# Altium schematic sheet MPU9150.SchDoc
size A
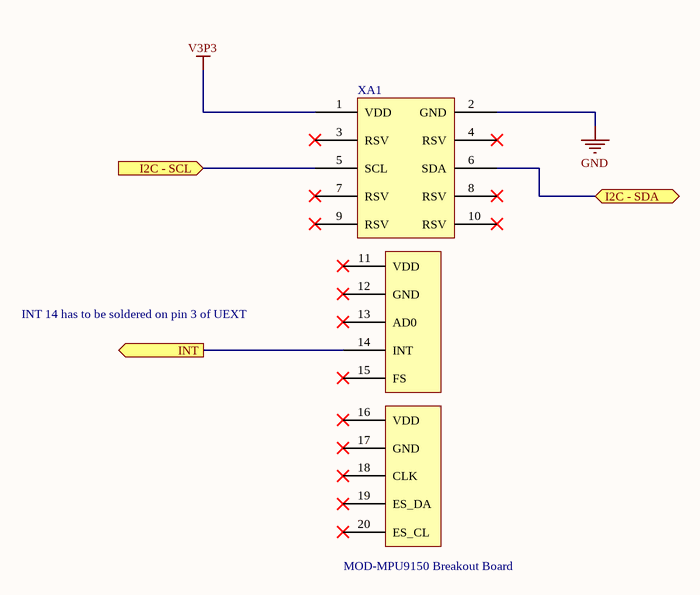
[diagram p0: MPU9150.SchDoc]

## Parts
XA1  MOD-MPU9150 Breakout Board  [MOD-MPU9150]

## Ports
I2C - SCL (in), I2C - SDA (bidir), INT (out)

## Nets
GND: XA1.2(GND)
V3P3: XA1.1(VDD)
I2C - SCL: XA1.5(SCL) ; port I2C - SCL
I2C - SDA: XA1.6(SDA) ; port I2C - SDA
INT: XA1.14(INT) ; port INT

Not connected (* = marked no-connect by the designer): XA1 3(RSV)* 4(RSV)* 7(RSV)* 8(RSV)* 9(RSV)* 10(RSV)* 11(VDD)* 12(GND)* 13(AD0)* 15(FS)* 16(VDD)* 17(GND)* 18(CLK)* 19(ES_DA)* 20(ES_CL)*

## Notes on the sheet
- INT 14 has to be soldered on pin 3 of UEXT

## Library data of the parts
XA1 = MPU9150: MPU9150 Breakout Board, displaying 3 headers; Fournisseur: Farnell; RefFournisseur: 2134098; Fabricant: 3M; RefFabricant: 30310-5002HB.; PackageDescription: 9axes